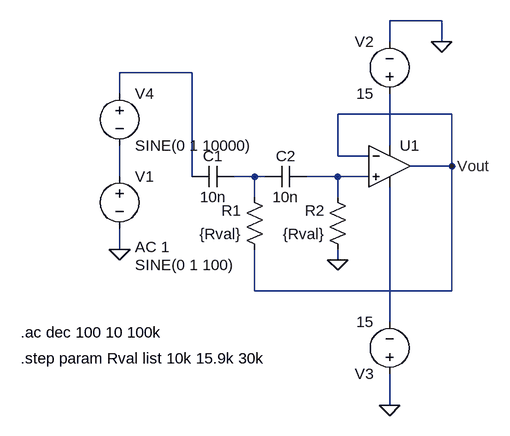
[diagram p0: schematic BPF.asc]
BPF.asc, the LTspice schematic file:
Version 4.1
SHEET 1 880 680
WIRE 0 -80 -80 -80
WIRE -80 -48 -80 -80
WIRE 0 -48 0 -80
WIRE -384 0 -496 0
WIRE -496 32 -496 0
WIRE 16 64 -160 64
WIRE -80 112 -80 32
WIRE -160 128 -160 64
WIRE -112 128 -160 128
WIRE 16 144 16 64
WIRE 16 144 -48 144
WIRE -496 160 -496 112
WIRE -384 160 -384 0
WIRE -288 160 -320 160
WIRE -272 160 -288 160
WIRE -160 160 -208 160
WIRE -112 160 -160 160
WIRE -288 192 -288 160
WIRE -160 192 -160 160
WIRE -496 272 -496 240
WIRE -160 288 -160 272
WIRE -288 336 -288 272
WIRE 16 336 16 144
WIRE 16 336 -288 336
WIRE -80 384 -80 176
WIRE -80 512 -80 464
FLAG -496 272 0
FLAG -160 288 0
FLAG 0 -48 0
FLAG -80 512 0
FLAG 16 144 Vout
SYMBOL OpAmps\\UniversalOpAmp2 -80 144 R0
SYMATTR InstName U1
SYMBOL res -272 288 R180
WINDOW 0 36 76 Left 2
WINDOW 3 36 40 Left 2
SYMATTR InstName R1
SYMATTR Value {Rval}
SYMBOL res -144 288 R180
WINDOW 0 36 76 Left 2
WINDOW 3 36 40 Left 2
SYMATTR InstName R2
SYMATTR Value {Rval}
SYMBOL cap -384 176 R270
WINDOW 0 32 32 VTop 2
WINDOW 3 0 32 VBottom 2
SYMATTR InstName C1
SYMATTR Value 10n
SYMBOL cap -272 176 R270
WINDOW 0 32 32 VTop 2
WINDOW 3 0 32 VBottom 2
SYMATTR InstName C2
SYMATTR Value 10n
SYMBOL voltage -496 144 R0
WINDOW 3 24 152 Left 2
WINDOW 123 24 124 Left 2
WINDOW 39 0 0 Left 0
SYMATTR Value SINE(0 1 100)
SYMATTR Value2 AC 1
SYMATTR InstName V1
SYMBOL voltage -80 48 R180
WINDOW 0 24 96 Left 2
WINDOW 3 24 16 Left 2
WINDOW 123 0 0 Left 0
WINDOW 39 0 0 Left 0
SYMATTR InstName V2
SYMATTR Value 15
SYMBOL voltage -80 480 R180
WINDOW 123 0 0 Left 0
WINDOW 39 0 0 Left 0
SYMATTR InstName V3
SYMATTR Value 15
SYMBOL voltage -496 16 R0
WINDOW 123 0 0 Left 0
WINDOW 39 0 0 Left 0
SYMATTR InstName V4
SYMATTR Value SINE(0 1 10000)
TEXT -648 400 Left 2 !.ac dec 100 10 100k
TEXT -648 440 Left 2 !.step param Rval list 10k 15.9k 30k

The netlist it stands for:
* BPF.asc
X§U1 N005 Vout N002 N006 Vout level2 Avol=1Meg GBW=10Meg Slew=10Meg Ilimit=25m Rail=0 Vos=0 En=0 Enk=0 In=0 Ink=0 Rin=500Meg  ; pins In+ In- V+ V- OUT
R1 Vout N004 {Rval}
R2 0 N005 {Rval}
C1 N001 N004 10n
C2 N004 N005 10n
V1 N003 0 SINE(0 1 100) AC 1
V2 N002 0 15
V3 0 N006 15
V4 N001 N003 SINE(0 1 10000)
.ac dec 100 10 100k
.step param Rval list 10k 15.9k 30k
.lib UniversalOpAmp2.lib
.backanno
.end